# Altium schematic sheet Address Mux.SchDoc
size B; Author: E. Sims; Organization: Let's Build Rockets Inc.; SheetNumber: 4; SheetTotal: 4
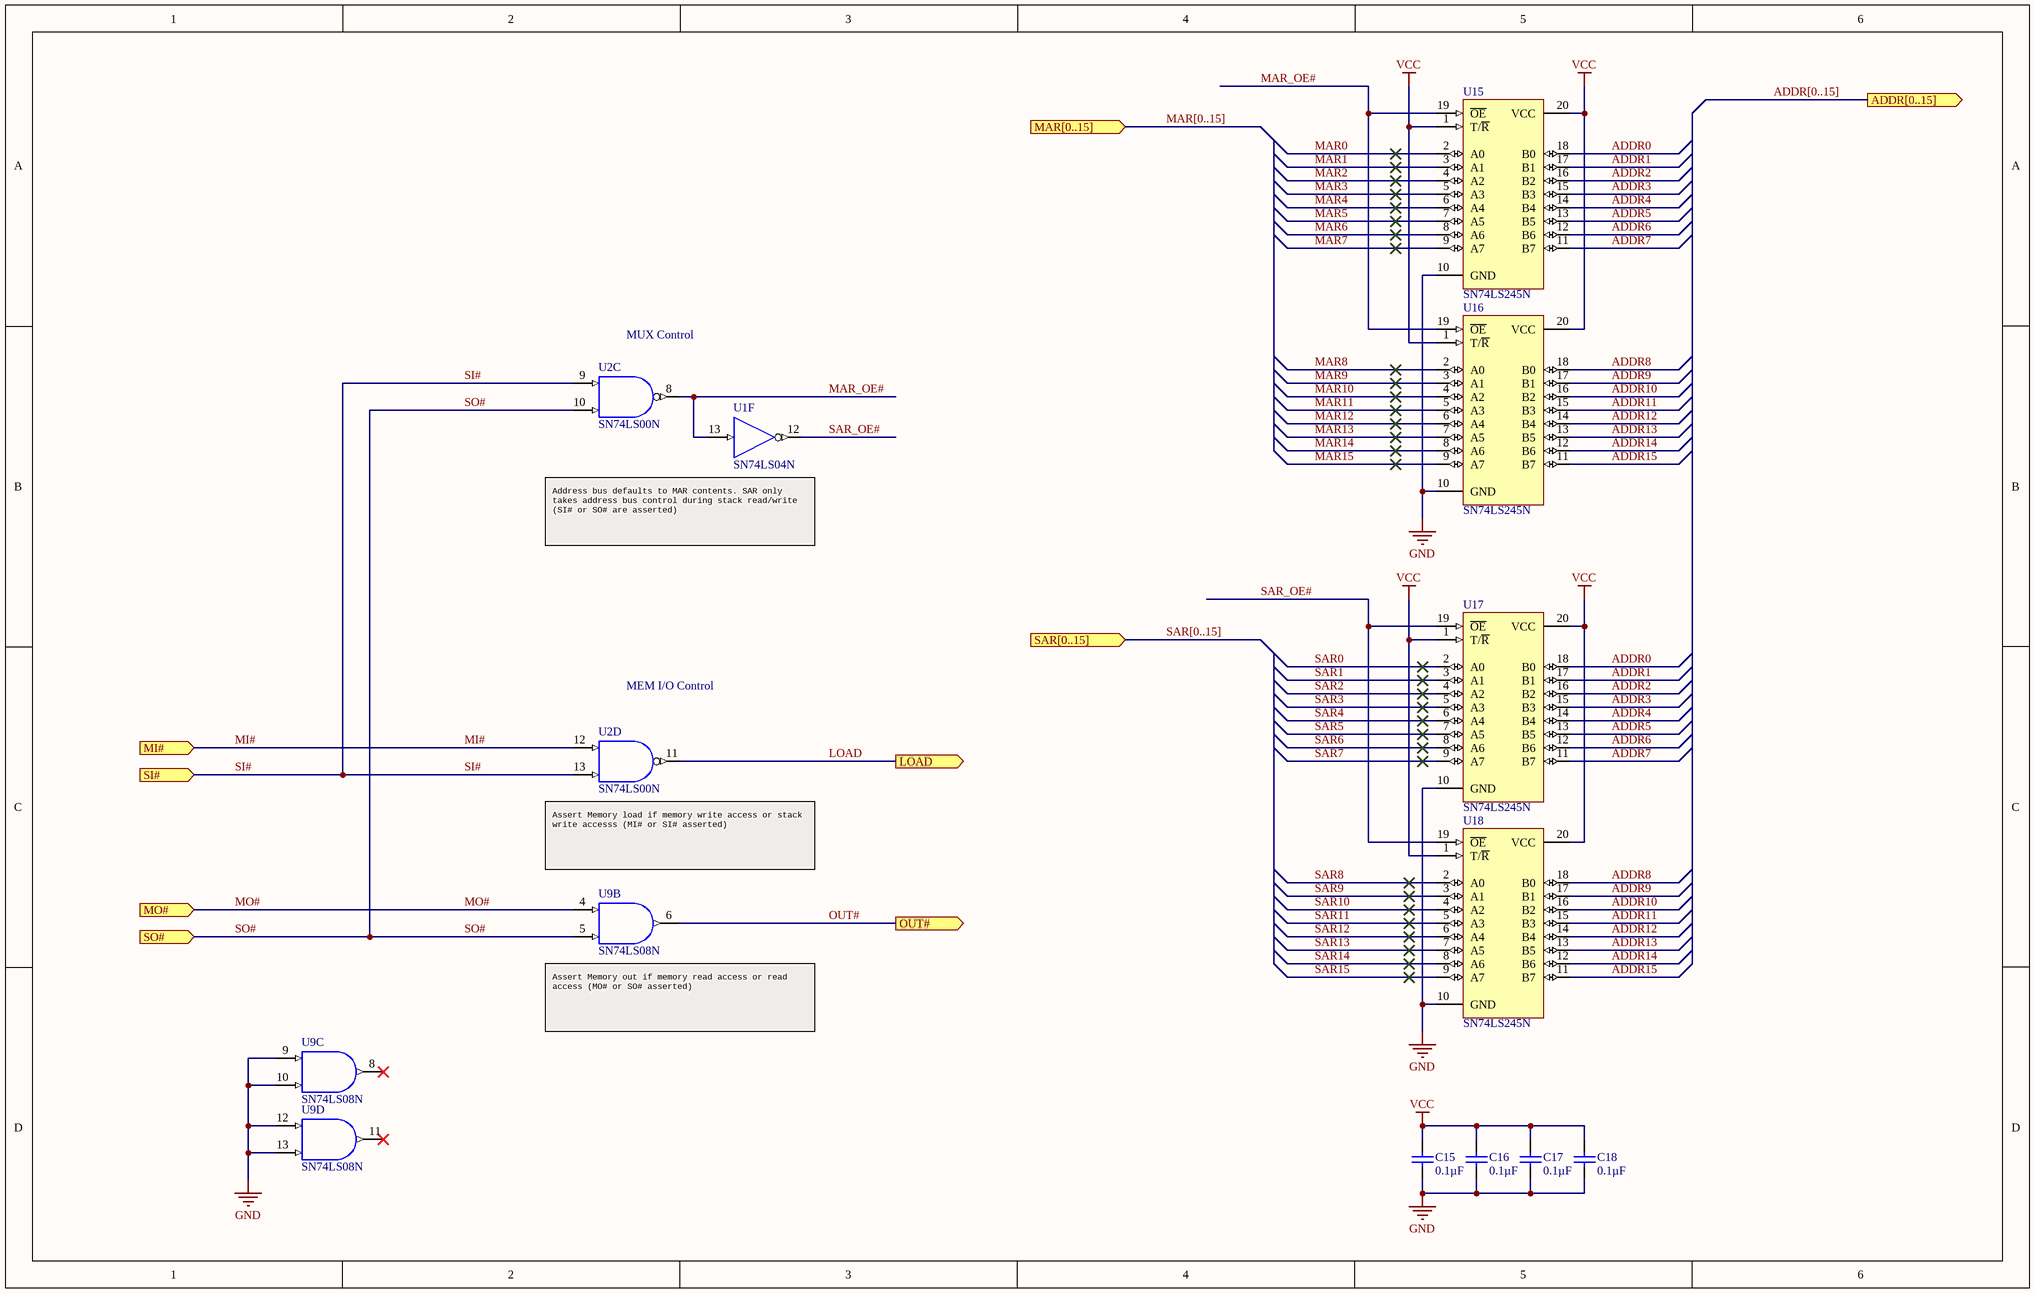
[diagram p0: Address Mux.SchDoc]

## Parts
C15  Capacitance: 0.1µF  [VISH-K104K15X7RF5TL2]  (hidden comment: K104K15X7RF5TL2)
C16  Capacitance: 0.1µF  [VISH-K104K15X7RF5TL2]  (hidden comment: K104K15X7RF5TL2)
C17  Capacitance: 0.1µF  [VISH-K104K15X7RF5TL2]  (hidden comment: K104K15X7RF5TL2)
C18  Capacitance: 0.1µF  [VISH-K104K15X7RF5TL2]  (hidden comment: K104K15X7RF5TL2)
U1  SN74LS04N  [N014]  (part F of 6)
U2  SN74LS00N  [N014]  (parts C,D of 4)
U9  SN74LS08N  [N014]  (parts B,C,D of 4)
U15  SN74LS245N  [N020]
U16  SN74LS245N  [N020]
U17  SN74LS245N  [N020]
U18  SN74LS245N  [N020]

## Ports
ADDR[0..15] (out), LOAD (out), MAR[0..15] (in), MI# (in), MO# (in), OUT# (out), SAR[0..15] (in), SI# (in), SO# (in)

## Nets
GND: C15.2 C16.2 C17.2 C18.2 U1.7(GND) U2.7(GND) U9.7(GND) U9.9(A) U9.10(B) U9.12(A) U9.13(B) U15.10(GND) U16.10(GND) U17.10(GND) U18.10(GND)
VCC: C15.1 C16.1 C17.1 C18.1 U1.14(VCC) U2.14(VCC) U9.14(VCC) U15.1(T/~{R}) U15.20(VCC) U16.1(T/~{R}) U16.20(VCC) U17.1(T/~{R}) U17.20(VCC) U18.1(T/~{R}) U18.20(VCC)
ADDR0: U15.18(B0) U17.18(B0)
ADDR1: U15.17(B1) U17.17(B1)
ADDR2: U15.16(B2) U17.16(B2)
ADDR3: U15.15(B3) U17.15(B3)
ADDR4: U15.14(B4) U17.14(B4)
ADDR5: U15.13(B5) U17.13(B5)
ADDR6: U15.12(B6) U17.12(B6)
ADDR7: U15.11(B7) U17.11(B7)
ADDR8: U16.18(B0) U18.18(B0)
ADDR9: U16.17(B1) U18.17(B1)
ADDR10: U16.16(B2) U18.16(B2)
ADDR11: U16.15(B3) U18.15(B3)
ADDR12: U16.14(B4) U18.14(B4)
ADDR13: U16.13(B5) U18.13(B5)
ADDR14: U16.12(B6) U18.12(B6)
ADDR15: U16.11(B7) U18.11(B7)
LOAD: U2.11(Y) ; port LOAD
MAR0: U15.2(A0)
MAR1: U15.3(A1)
MAR2: U15.4(A2)
MAR3: U15.5(A3)
MAR4: U15.6(A4)
MAR5: U15.7(A5)
MAR6: U15.8(A6)
MAR7: U15.9(A7)
MAR8: U16.2(A0)
MAR9: U16.3(A1)
MAR10: U16.4(A2)
MAR11: U16.5(A3)
MAR12: U16.6(A4)
MAR13: U16.7(A5)
MAR14: U16.8(A6)
MAR15: U16.9(A7)
MAR_OE#: U1.13(A) U2.8(Y) U15.19(~{OE}) U16.19(~{OE})
MI#: U2.12(A) ; port MI#
MO#: U9.4(A) ; port MO#
OUT#: U9.6(Y) ; port OUT#
SAR0: U17.2(A0)
SAR1: U17.3(A1)
SAR2: U17.4(A2)
SAR3: U17.5(A3)
SAR4: U17.6(A4)
SAR5: U17.7(A5)
SAR6: U17.8(A6)
SAR7: U17.9(A7)
SAR8: U18.2(A0)
SAR9: U18.3(A1)
SAR10: U18.4(A2)
SAR11: U18.5(A3)
SAR12: U18.6(A4)
SAR13: U18.7(A5)
SAR14: U18.8(A6)
SAR15: U18.9(A7)
SAR_OE#: U1.12(Y) U17.19(~{OE}) U18.19(~{OE})
SI#: U2.9(A) U2.13(B) ; port SI#
SO#: U2.10(B) U9.5(B) ; port SO#

Not connected (* = marked no-connect by the designer): U9 8(Y)* 11(Y)*

## Buses and harness runs
bus ADDR[0..15] = port ADDR[0..15]
bus MAR[0..15] = port MAR[0..15]
bus SAR[0..15] = port SAR[0..15]

## Notes on the sheet
- (near U2) MUX Control
- (near U1) Address bus defaults to MAR contents. SAR only takes address bus control during stack read/write (SI# or SO# are asserted)
- MEM I/O Control
- Assert Memory load if memory write access or stack write accesss (MI# or SI# asserted)
- (near U9) Assert Memory out if memory read access or read access (MO# or SO# asserted)
- Let's Build Rocket's Inc. Modular Paylaod System Based on TMP-010 Rev
  For more information visit https://github.com/LetsBuildRockets/Modular-Payload-System
  This work is licensed under CC BY-NC 4.0. To view a copy of this license, visit https://creativecommons.org/licenses/by-nc/4.0
- Title
- Size:
- Date:
- Assembly Variant:
- B
- Number:
- Time:
- Revision:
- Sheet
- of
- Author:
- File:

## Library data of the parts
C15-C18 = CMP-2000-06508-1: Ceramic Capacitor, 100 nF, +/- 10%, 50 V, -55 to 125 degC, 2-Pin THD, RoHS, Tape and Reel; Manufacturer: Vishay; Other Names: BC1084CT; Catalog Drawings: Mono-KapSide2-15_5.58Mono-KapSide1_15; Temperature Coefficient: X7R; Voltage - Rated: 50V; Online Catalog: Mono-Kap™Series; Size / Dimension: 0.157"Lx0.098"W(4.00mmx2.50mm); Operating Temperature: -55°C~125°C; Family: CeramicCapacitors; Manufacturer URL: http://www.vishay.com/; Standard Package: 1; Thickness (Max): -; Ratings: -; Datasheet Version: 08/2013; Package Description: 2-Pin Through Hole Device, Body 4 x 2.6 mm; Mounting Type: ThroughHole; Features: -; Lead Spacing: 0.098"(2.50mm); Tolerance: ±10%; Category: Capacitors; Mounting Technology: ThroughHole; Lead Style: Straight; Datasheet URL: http://www.vishay.com/docs/45171/kseries.pdf; Applications: GeneralPurpose; Package / Case: Radial; Height - Seated (Max): 0.220"(5.58mm); Package Reference: K104K15X7RF5TL2; Series: Mono-Kap™K; Packaging: CutTape(CT)
U1 = SN74LS04N: Hex Inverter; Published: 8-Jun-2000; LatestRevisionDate: 04-Mar-2005; LatestRevisionNote: Stylized 3D Model Added.; DatasheetVersion: Mar-1988; PackageVersion: Oct-1995; PackageReference: N014; Publisher: Altium Limited; PackageDescription: DIP; 14 Leads; Row Spacing 7.62 mm; Pitch 2.54 mm; ComponentLink1Description: Manufacturer Link; ComponentLink1URL: http://www.ti.com/; ComponentLink2Description: Datasheet; ComponentLink2URL: http://www-s.ti.com/sc/ds/sn74ls04.pdf
U2 = SN74LS00N: Quadruple 2-Input Positive-NAND Gate; Published: 8-Jun-2000; LatestRevisionDate: 04-Mar-2005; LatestRevisionNote: Stylized 3D Model Added.; DatasheetVersion: Mar-1988; PackageVersion: Oct-1995; PackageReference: N014; Publisher: Altium Limited; PackageDescription: DIP; 14 Leads; Row Spacing 7.62 mm; Pitch 2.54 mm; ComponentLink1Description: Manufacturer Link; ComponentLink1URL: http://www.ti.com/; ComponentLink2Description: Datasheet; ComponentLink2URL: http://www-s.ti.com/sc/ds/sn74ls00.pdf
U9 = SN74LS08N: Quadruple 2-Input Positive-AND Gate; Published: 8-Jun-2000; LatestRevisionDate: 04-Mar-2005; LatestRevisionNote: Stylized 3D Model Added.; DatasheetVersion: Mar-1988; PackageVersion: Oct-1995; PackageReference: N014; Publisher: Altium Limited; PackageDescription: DIP; 14 Leads; Row Spacing 7.62 mm; Pitch 2.54 mm; ComponentLink1Description: Manufacturer Link; ComponentLink1URL: http://www.ti.com/; ComponentLink2Description: Datasheet; ComponentLink2URL: http://www-s.ti.com/sc/ds/SN74LS08.pdf
U15-U18 = SN74LS245N: Octal Bus Transceiver with 3-State Outputs; Published: 8-Jun-2000; LatestRevisionDate: 04-Mar-2005; LatestRevisionNote: Stylized 3D Model Added.; DatasheetVersion: Mar-1988; PackageVersion: Oct-1995; PackageReference: N020; Publisher: Altium Limited; PackageDescription: DIP; 20 Leads; Row Spacing 7.62 mm; Pitch 2.54 mm; ComponentLink1Description: Manufacturer Link; ComponentLink1URL: http://www.ti.com/; ComponentLink2Description: Datasheet; ComponentLink2URL: http://www-s.ti.com/sc/ds/sn74ls245.pdf